# EAGLE design mini8 (EAGLE 5.03)
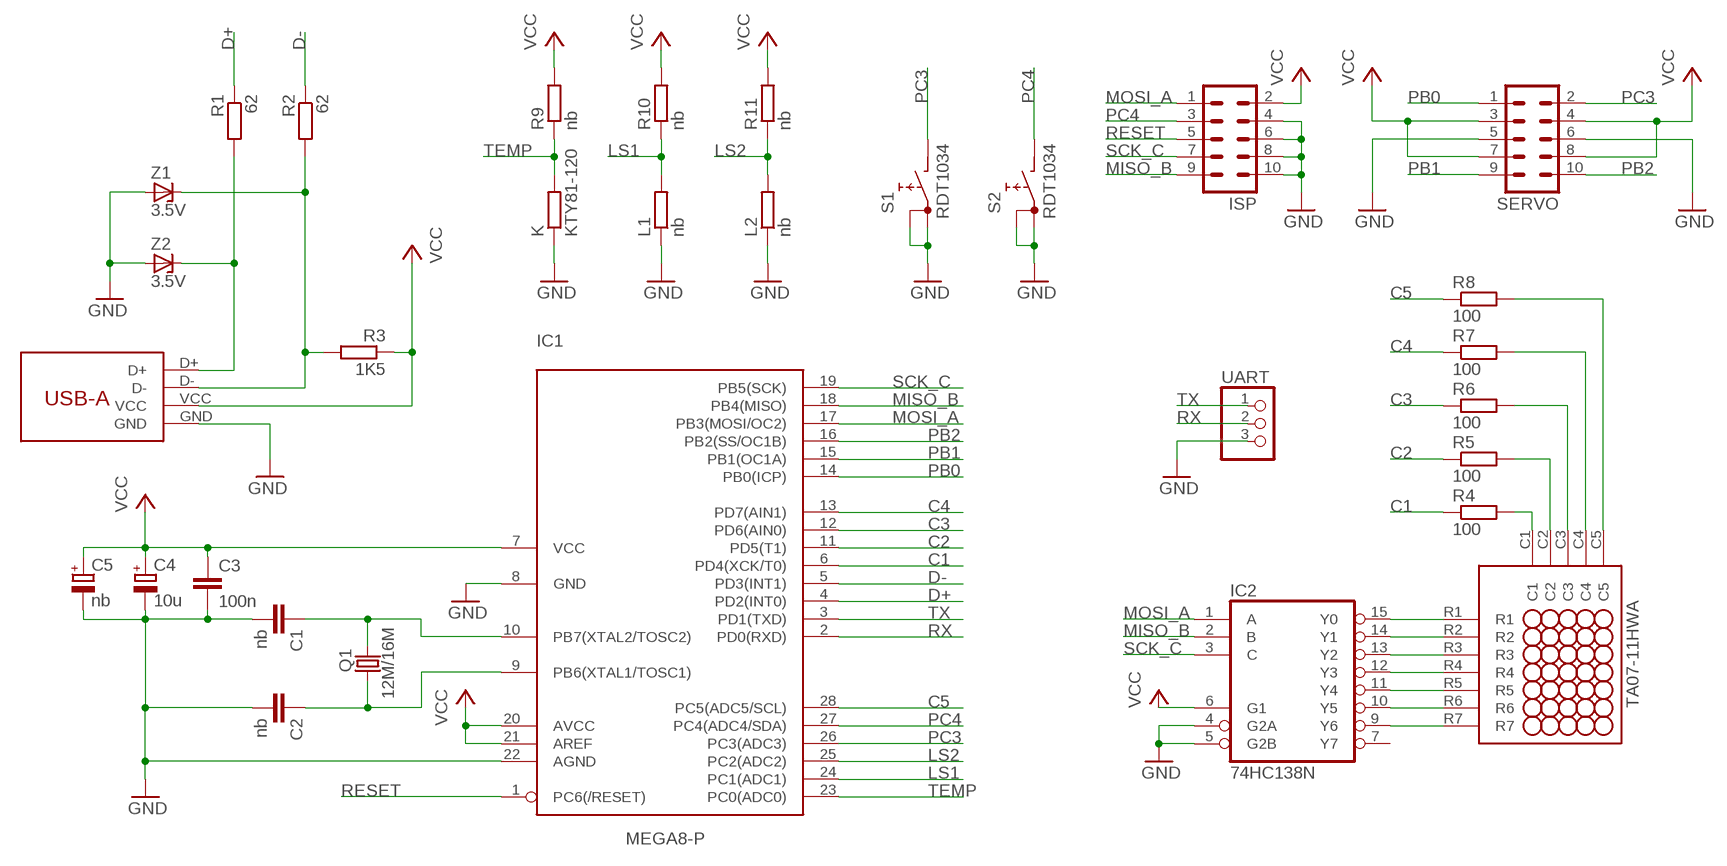
[diagram p0: schematic, sheet 1]

## Parts
C1  nb  C-EU050-025X075  [C050-025X075]
C2  nb  C-EU050-025X075  [C050-025X075]
C3  100n  C-EU050-025X075  [C050-025X075]
C4  10u  CPOL-EUTT2D4  [TT2D4]
C5  nb  CPOL-EUB45181B  [B45181B]
IC1  MEGA8-P  [DIL28-3]
IC2  74HC138N  [DIL16]
ISP  ML10  [ML10]
K  KTY81-120  R-EU_0204/2V  [0204V]
L1  nb  R-EU_0204/2V  [0204V]
L2  nb  R-EU_0204/2V  [0204V]
Q1  12M/16M  CRYSTALHC49S  [HC49/S]
R1  62  R-EU_0207/10  [0207/10]
R2  62  R-EU_0207/7  [0207/7]
R3  1K5  R-EU_0207/7  [0207/7]
R4  100  R-EU_0207/7  [0207/7]
R5  100  R-EU_0207/7  [0207/7]
R6  100  R-EU_0207/7  [0207/7]
R7  100  R-EU_0207/7  [0207/7]
R8  100  R-EU_0207/7  [0207/7]
R9  nb  R-EU_0207/7  [0207/7]
R10  nb  R-EU_0207/7  [0207/7]
R11  nb  R-EU_0207/7  [0207/7]
S1  RDT1034  [RDT1034]
S2  RDT1034  [RDT1034]
SERVO  ML10  [ML10]
U$1  TA07-11HWADIL  [DIL12]
U$2  USB-A  [DIP]
UART  PINHD-1X3  [1X03]
Z1  3.5V  BZX90  [DO34Z7]
Z2  3.5V  BZX90  [DO34Z7]

## Nets
C1: IC1.6(PD4(XCK/T0)) R4.1
C2: IC1.11(PD5(T1)) R5.1
C3: IC1.12(PD6(AIN0)) R6.1
C4: IC1.13(PD7(AIN1)) R7.1
C5: IC1.28(PC5(ADC5/SCL)) R8.1
D+: IC1.4(PD2(INT0)) R1.1
D-: IC1.5(PD3(INT1)) R2.1
GND: C1.2 C2.2 C3.2 C4.- C5.- IC1.8(GND) IC1.22(AGND) IC2.4(G2A) IC2.5(G2B) ISP.4 ISP.6 ISP.8 ISP.10 K.1 L1.1 L2.1 S1.A S1.A1 S2.A S2.A1 SERVO.5 SERVO.6 U$2.GND UART.3 Z1.A Z2.A
LS1: IC1.24(PC1(ADC1)) L1.2 R10.1
LS2: IC1.25(PC2(ADC2)) L2.2 R11.1
MISO_B: IC1.18(PB4(MISO)) IC2.2(B) ISP.9
MOSI_A: IC1.17(PB3(MOSI/OC2)) IC2.1(A) ISP.1
N$1: R1.2 U$2.D+ Z2.C
N$2: R2.2 R3.2 U$2.D- Z1.C
N$3: IC2.15(Y0) U$1.R1
N$4: C1.1 IC1.10(PB7(XTAL2/TOSC2)) Q1.2
N$5: C2.1 IC1.9(PB6(XTAL1/TOSC1)) Q1.1
N$6: IC2.14(Y1) U$1.R2
N$7: IC2.13(Y2) U$1.R3
N$8: IC2.12(Y3) U$1.R4
N$9: IC2.11(Y4) U$1.R5
N$10: IC2.10(Y5) U$1.R6
N$11: IC2.9(Y6) U$1.R7
N$13: R4.2 U$1.C1
N$14: R5.2 U$1.C2
N$15: R6.2 U$1.C3
N$16: R7.2 U$1.C4
N$17: R8.2 U$1.C5
PB0: IC1.14(PB0(ICP)) SERVO.1
PB1: IC1.15(PB1(OC1A)) SERVO.9
PB2: IC1.16(PB2(SS/OC1B)) SERVO.10
PC3: IC1.26(PC3(ADC3)) S1.B SERVO.2
PC4: IC1.27(PC4(ADC4/SDA)) ISP.3 S2.B
RESET: IC1.1(PC6(/RESET)) ISP.5
RX: IC1.2(PD0(RXD)) UART.2
SCK_C: IC1.19(PB5(SCK)) IC2.3(C) ISP.7
TEMP: IC1.23(PC0(ADC0)) K.2 R9.1
TX: IC1.3(PD1(TXD)) UART.1
VCC: C3.1 C4.+ C5.+ IC1.7(VCC) IC1.20(AVCC) IC1.21(AREF) IC2.6(G1) ISP.2 R3.1 R9.2 R10.2 R11.2 SERVO.3 SERVO.4 SERVO.7 SERVO.8 U$2.VCC
Unconnected: IC2.7(Y7)

## Power pins joined to a net without a drawn wire
GND: IC2.8(GND)
VCC: IC2.16(VCC)

## Library data of the parts
C1-C3 = rcl:C-EU: CAPACITOR, European symbol
C4 C5 = rcl:CPOL-EU: POLARIZED CAPACITOR, European symbol
IC1 = atmel:MEGA8-P: MICROCONTROLLER 8 Kbytes FLASH 1 kbytes SRAM 512 bytes EEPROM USART 4-channel 10 bit ADC 2-channel 8 bit ADC Source: avr.lbr
IC2 = 74xx-eu:74*138: 3-line to 8-line DECODER/DEMULTIPLEXER
ISP SERVO = con-harting-ml:ML10: HARTING
K L1 L2 R1-R11 = rcl:R-EU_: RESISTOR, European symbol
Q1 = crystal:CRYSTAL: CRYSTAL
S1 S2 = switch:RDT1034: PUSH SWITCH www.radiohm.com
U$1 = TA07-11HWA:TA07-11HWA
U$2 = assmann-usb-a-dip:USB-A
UART = pinhead:PINHD-1X3: PIN HEADER
Z1 Z2 = diode:BZX90: Z DIODE

## Board
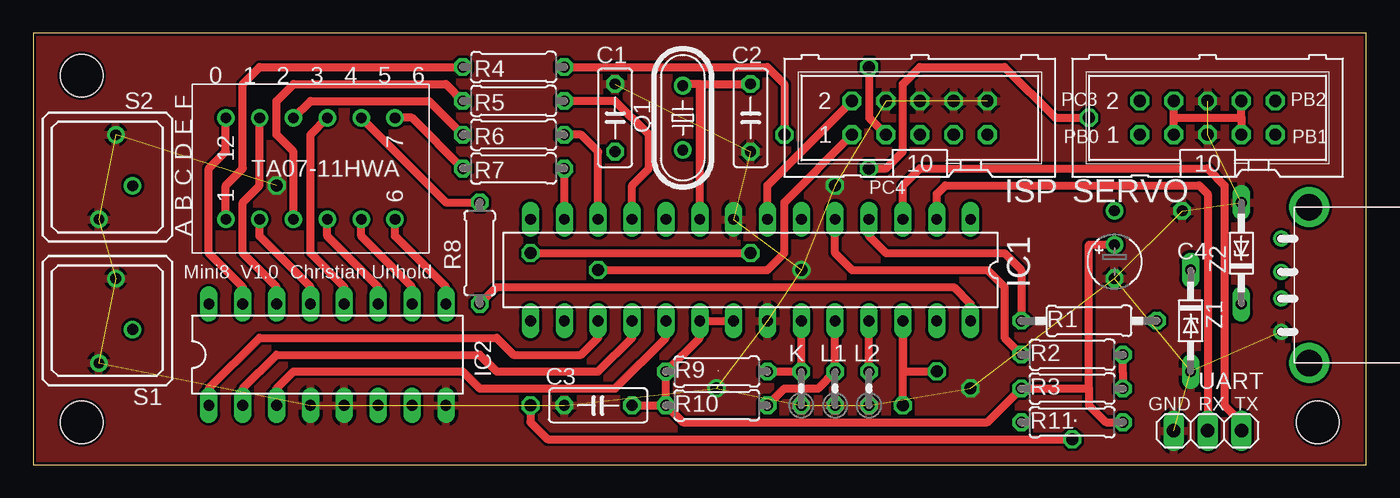
[diagram p1: board, top side]
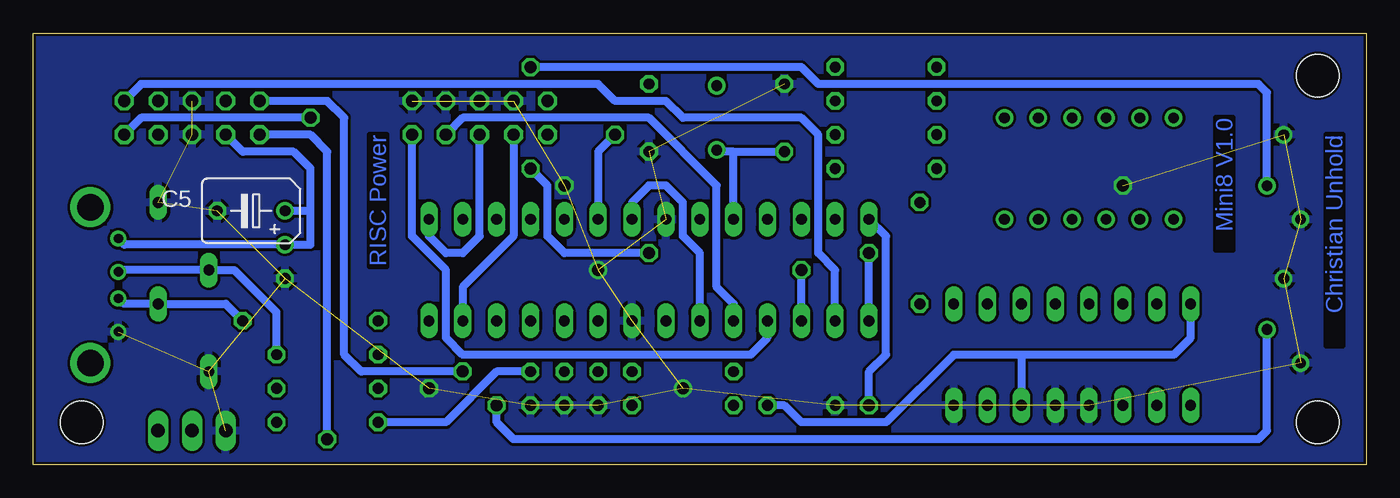
[diagram p2: board, bottom side, seen from below]

Size 100 x 32.38 mm. Coordinates in mm from the lower left corner, seen from the top.
Outline: 0,0 100,0 100,32.38 0,32.38 0,0
Copper layers (1*16): Top 0.035mm / dielectric 1.5mm / Bottom 0.035mm
Design rules "default": minimum track width 10mil, minimum drill 24mil, track to track 8mil, track to pad 8mil, pad to pad 8mil, via to via 8mil, smd to smd 8mil, copper to edge 8mil, drill to drill 8mil, minimum pad ring 10mil, minimum via ring 8mil, stop-mask expansion 4mil, vias tented up to drill 0mil, thermal gap 10mil
Holes 3.2 mm at 3.64,29.2 3.64,3.17 96.36,3.17

### Footprints (pad centres in the part's own frame; a part is rotated, then mirrored left to right if it is on the bottom)
C050-025X075 = drill 0.813 octagon: 1 -2.54,0; 2 2.54,0
TT2D4 = drill 0.813 round: + -1.27,0 | drill 0.813 octagon: - 1.27,0
B45181B = drill 0.813 round: + -2.54,0 | drill 0.813 octagon: - 2.54,0
DIL28-3 = drill 0.813 long: 1 -16.51,-3.81; 2 -13.97,-3.81; 3 -11.43,-3.81; 4 -8.89,-3.81; 5 -6.35,-3.81; 6 -3.81,-3.81; 7 -1.27,-3.81; 8 1.27,-3.81; 9 3.81,-3.81; 10 6.35,-3.81; 11 8.89,-3.81; 12 11.43,-3.81; 13 13.97,-3.81; 14 16.51,-3.81; 15 16.51,3.81; 16 13.97,3.81; 17 11.43,3.81; 18 8.89,3.81; 19 6.35,3.81; 20 3.81,3.81; 21 1.27,3.81; 22 -1.27,3.81; 23 -3.81,3.81; 24 -6.35,3.81; 25 -8.89,3.81; 26 -11.43,3.81; 27 -13.97,3.81; 28 -16.51,3.81
DIL16 = drill 0.813 long: 1 -8.89,-3.81; 2 -6.35,-3.81; 3 -3.81,-3.81; 4 -1.27,-3.81; 5 1.27,-3.81; 6 3.81,-3.81; 7 6.35,-3.81; 8 8.89,-3.81; 9 8.89,3.81; 10 6.35,3.81; 11 3.81,3.81; 12 1.27,3.81; 13 -1.27,3.81; 14 -3.81,3.81; 15 -6.35,3.81; 16 -8.89,3.81
ML10 = drill 0.914 octagon: 1 -5.08,-1.27; 2 -5.08,1.27; 3 -2.54,-1.27; 4 -2.54,1.27; 5 0,-1.27; 6 0,1.27; 7 2.54,-1.27; 8 2.54,1.27; 9 5.08,-1.27; 10 5.08,1.27
0204V = drill 0.813 octagon: 1 -1.27,0; 2 1.27,0
HC49/S = drill 0.813 round: 1 -2.413,0; 2 2.413,0
0207/10 = drill 0.813 octagon: 1 -5.08,0; 2 5.08,0
0207/7 = drill 0.813 octagon: 1 -3.81,0; 2 3.81,0
RDT1034 = drill 0.8 round: A 3.175,-0.635; A1 -3.175,0.635; B 0.65,1.9
DIL12 = drill 0.8 round: C1 -3.81,13.97; C2 -3.81,8.89; C3 3.81,8.89; C4 3.81,1.27; C5 3.81,3.81; R1 3.81,13.97; R2 3.81,11.43; R3 -3.81,11.43; R4 3.81,6.35; R5 -3.81,6.35; R6 -3.81,3.81; R7 -3.81,1.27
DIP = drill 0.7 round: D+ 4.85,2.1; D- 6.85,2.1; GND 2.35,2.1; VCC 9.35,2.1 | drill 2 round: P$1 0,0; P$2 11.7,0
1X03 = drill 1.016 long: 1 -2.54,0; 2 0,0; 3 2.54,0
DO34Z7 = drill 0.813 long: A 3.81,0; C -3.81,0

### Placement (x,y rotation side)
C1  43.65,26.03 90 top
C2  53.81,26.03 270 top
C3  42.38,4.44 180 top
C4  81.11,15.24 270 top
C5  83.66,19.04 180 bottom
IC1  53.81,14.6 180 top
IC2  22.06,8.25 0 top
ISP  66.51,26.03 0 top
K  57.62,5.71 90 top
L1  60.16,5.71 90 top
L2  62.7,5.71 90 top
Q1  48.73,26.03 270 top
R1  79.21,10.79 0 top
R2  77.94,8.25 0 top
R3  77.94,5.71 0 top
R4  36.03,29.84 180 top
R5  36.03,27.3 180 top
R6  36.03,24.76 180 top
R7  36.03,22.22 180 top
R8  33.49,15.87 90 top
R9  51.27,6.98 180 top
R10  51.27,4.44 180 top
R11  77.94,3.17 0 top
S1  5.55,10.79 270 top
S2  5.55,21.58 270 top
SERVO  88.1,26.03 0 top
U$1  28.41,22.22 90 top
U$2  95.72,7.62 90 top
UART  88.1,2.54 180 top
Z1  86.83,10.79 270 top
Z2  90.64,15.87 90 top

### Tracks (layer width: path | path; a pad name or v marks a point on that pad's centre or on a via)
C1  (via drill 0.9)
  Top 0.61: R4.1 55.08,29.84 56.35,28.57 v56.35,24.76
  Bottom 0.61: v56.35,24.76 57.62,23.49 IC1.6
C2
  Top 0.61: IC1.11 44.92,20.95 46.19,22.22 46.19,24.76 43.65,27.3 R5.1
C3
  Top 0.61: IC1.12 42.38,23.49 41.11,24.76 R6.1
C4
  Top 0.61: IC1.13 R7.1
C5
  Top 0.61: IC1.28 70.32,12.06 69.05,13.33 34.76,13.33 R8.1
D+
  Top 0.61: R1.1 74.13,14.6 72.86,15.87 63.97,15.87 62.7,17.14 IC1.4
D-
  Top 0.61: R2.1 72.86,9.52 72.86,13.33 71.59,14.6 61.43,14.6 60.16,15.87 IC1.5
GND  (via drill 0.9)  (31 unrouted)
  other vias: 51.27,5.71 70.32,5.71 57.62,14.6 18.25,20.95 60.16,20.95
  pour Top: -0.8,33.02 100.8,33.02 100.8,-0.64 -0.8,-0.64
  pour Bottom: -0.8,33.02 100.8,33.02 100.8,-0.64 -0.8,-0.64
LS1
  Top 0.61: IC1.24 L1.2 58.89,5.71 56.35,5.71 R10.1
LS2
  Top 0.61: L2.2 IC1.25
  Bottom 0.61: L2.2 65.24,6.98 69.05,3.17 R11.1
MISO_B
  Top 0.61: IC2.2 15.71,5.71 18.25,8.25 33.49,8.25 34.76,6.98 42.38,6.98 44.92,9.52 IC1.18
  Bottom 0.61: ISP.9 71.59,17.14 69.05,14.6 69.05,9.52 67.78,8.25 46.19,8.25 44.92,9.52 IC1.18
MOSI_A  (via drill 0.9)
  Top 0.61: IC1.17 42.38,9.52 41.11,8.25 36.03,8.25 34.76,9.52 16.98,9.52 13.17,5.71 IC2.1 | ISP.1 56.35,19.68 56.35,15.87 55.08,14.6 v42.38,14.6
  Bottom 0.61: IC1.17 v42.38,14.6
N$1
  Bottom 0.61: U$2.D+ 93.22,12.06 Z2.C 85.56,12.06 R1.2
N$2
  Top 0.61: R2.2 81.73,8.27 81.73,6.96 R3.2
  Bottom 0.61: R2.2 81.75,11.43 84.92,14.6 Z1.C 93.48,14.6 U$2.D-
N$3
  Top 0.61: IC2.15 15.71,13.33 13.17,15.87 13.17,22.22 14.44,23.49 U$1.R1
N$4
  Bottom 0.61: IC1.10 47.46,23.49 | Q1.2 48.73,23.49 47.46,23.49 | 47.46,23.49 C1.1
N$5
  Top 0.61: IC1.9 50,28.57 | Q1.1 48.73,28.57 50,28.57 | 50,28.57 C2.1
N$6
  Top 0.61: IC2.14 18.25,13.33 15.71,15.87 15.71,19.68 16.98,20.95 U$1.R2
N$7
  Top 0.61: IC2.13 20.79,13.33 16.98,17.14 U$1.R3
N$8
  Top 0.61: IC2.12 23.33,13.33 20.79,15.87 20.79,24.76 U$1.R4
N$9
  Top 0.61: IC2.11 25.87,13.33 22.06,17.14 U$1.R5
N$10
  Top 0.61: U$1.R6 24.6,17.14 28.41,13.33 IC2.10
N$11
  Top 0.61: U$1.R7 27.14,17.14 30.95,13.33 IC2.9
N$13
  Top 0.61: R4.2 16.98,29.84 15.71,28.57 15.71,22.22 14.44,20.95 U$1.C1
N$14
  Top 0.61: R5.2 30.95,28.57 19.52,28.57 18.25,27.3 18.25,24.76 19.52,23.49 U$1.C2
N$15
  Top 0.61: R6.2 29.68,27.3 20.79,27.3 U$1.C3
N$16
  Top 0.61: R7.2 28.41,26.03 U$1.C4
N$17
  Top 0.61: R8.2 30.95,19.68 U$1.C5
PB0  (via drill 0.9)
  Top 0.61: v37.3,4.44 37.3,3.17 38.57,1.9 v77.94,1.9
  Bottom 0.61: IC1.14 36.03,17.14 36.03,8.25 37.3,6.98 v37.3,4.44 | v77.94,1.9 77.94,23.49 79.21,24.76 SERVO.1
PB1  (via drill 0.9)
  Top 0.61: v79.21,26.03 76.67,26.03 72.86,29.84 66.51,29.84 65.24,28.57 65.24,23.49 63.97,22.22 v62.7,22.22 | v37.3,15.87 v53.81,15.87
  Bottom 0.61: SERVO.9 91.91,26.03 v79.21,26.03 | v62.7,22.22 61.43,20.95 61.43,17.14 60.16,15.87 v53.81,15.87 | IC1.15 v37.3,15.87
PB2
  Bottom 0.61: IC1.16 39.84,14.6 41.11,15.87 41.11,24.76 42.38,26.03 51.27,26.03 52.54,27.3 56.35,27.3 57.62,28.57 91.91,28.57 SERVO.10
PC3  (via drill 0.9)
  Top 0.61: v65.24,4.44 IC1.26 65.24,6.98 v67.78,6.98
  Bottom 0.61: v65.24,4.44 65.24,3.17 63.97,1.9 8.09,1.9 7.46,2.54 7.47,8.24 S1.B | v67.78,6.98 75.4,6.98 76.67,8.25 76.67,26.03 77.94,27.3 SERVO.2
PC4  (via drill 0.9)
  Top 0.61: v62.7,29.84 62.7,26.03 ISP.3
  Bottom 0.61: ISP.3 63.97,17.14 67.78,13.33 IC1.27 | S2.B 7.45,27.93 8.09,28.57 41.11,28.57 42.38,29.84 v62.7,29.84
RESET
  Bottom 0.61: IC1.1 70.32,17.14 69.05,15.87 67.78,15.87 66.51,17.14 ISP.5
RX
  Top 0.61: IC1.2 67.78,20.31 68.41,20.95 87.47,20.95 88.1,20.31 UART.2
SCK_C
  Top 0.61: IC2.3 18.25,5.71 19.52,6.98 32.22,6.98 33.49,5.71 43.65,5.71 47.46,9.52 IC1.19
  Bottom 0.61: ISP.7 67.78,26.03 53.81,26.03 48.73,20.95 48.73,13.33 47.46,12.06 IC1.19
TEMP
  Top 0.61: IC1.23 K.2 R9.1
TX
  Top 0.61: IC1.3 65.24,20.95 66.51,22.22 88.1,22.22 89.37,20.95 89.37,4.44 90.64,3.17 UART.1
VCC
  Top 0.61: 79.21,5.71 R3.1 71.59,3.17 48.73,3.17 R10.2 | 79.21,5.71 79.21,4.44 80.48,3.17 R11.2 | SERVO.3 85.56,26.03 | 79.21,5.71 79.21,16.5 C4.+ | IC1.21 IC1.20 50,9.52 R9.2 R10.2 | C3.1 R10.2 | IC1.7 55.08,20.95 ISP.2 | 85.56,26.03 SERVO.4 | 85.56,26.03 90.64,26.03 | 90.64,26.03 SERVO.8 | 90.64,26.03 SERVO.7
  Bottom 0.61: SERVO.3 84.29,23.49 80.48,23.49 79.21,22.22 79.21,19.04 | 79.21,19.04 79.21,16.5 C4.+ 93.18,16.5 93.64,16.96 U$2.VCC | IC1.7 55.08,19.68 53.81,20.95 52.54,20.95 51.27,19.68 51.27,17.14 50,15.87 IC1.20 | IC2.16 13.17,9.52 14.44,8.25 25.87,8.25 | 25.87,8.25 IC2.6 | C3.1 43.65,4.44 42.38,3.17 36.03,3.17 30.95,8.25 25.87,8.25 | 79.21,19.04 C5.+

### Text on the board
Bottom: Mini8 V1.0 | Christian Unhold | RISC Power
tPlace: 0 | 1 | 2 | 3 | 4 | 5 | 6 | F | E | D | C | B | A | . | GND | RX | TX | .
tNames: PC3 | PB2 | PB0 | PB1 | PC4 | Mini8 V1.0 Christian Unhold